# Altium project MMB_Power.PrjPcb
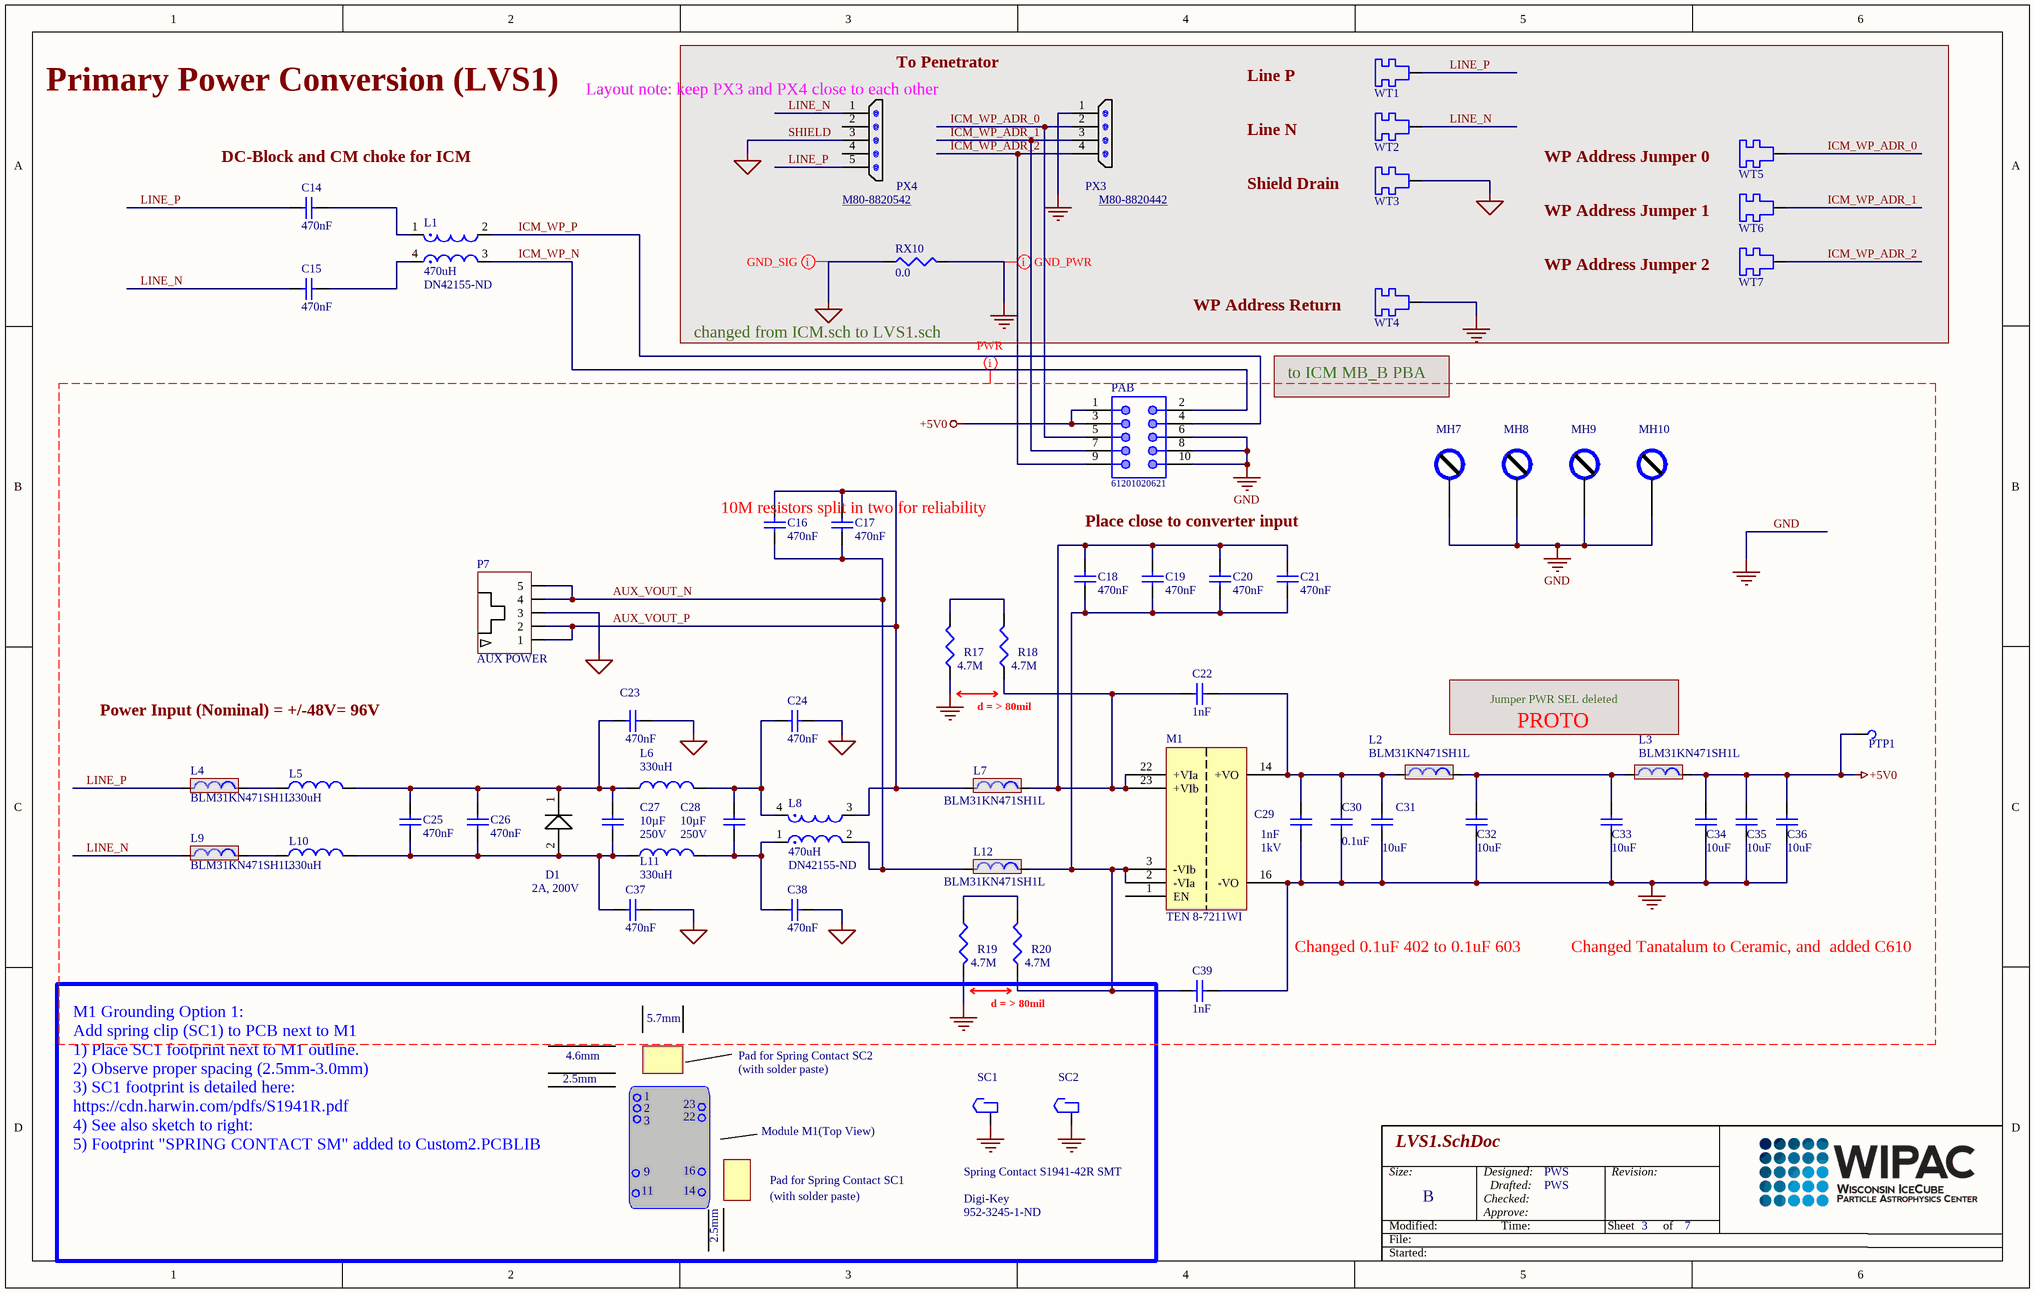
[diagram p0: LVS1.SchDoc]
1 sheet, 63 parts. Net scope: global (net labels, ports and power ports of the same name join across sheets).
Board file: MMB_Power_Board.PcbDoc

## Sheet LVS1.SchDoc
size B; DrawnBy: PWS; Engineer: PWS; DocumentNumber: 3; Revision: 2; SheetNumber: 3; SheetTotal: 7

### Parts
C14  Capacitance: 470nF  [1812]  (hidden comment: 470nF_1812_450V)
C15  Capacitance: 470nF  [1812]  (hidden comment: 470nF_1812_450V)
C16  Capacitance: 470nF  [1812]  (hidden comment: 470nF_1812_450V)
C17  Capacitance: 470nF  [1812]  (hidden comment: 470nF_1812_450V)
C18  Capacitance: 470nF  [1812]  (hidden comment: 470nF_1812_450V)
C19  Capacitance: 470nF  [1812]  (hidden comment: 470nF_1812_450V)
C20  Capacitance: 470nF  [1812]  (hidden comment: 470nF_1812_450V)
C21  Capacitance: 470nF  [1812]  (hidden comment: 470nF_1812_450V)
C22  Capacitance: 1nF  [CAPC_1206]  (hidden comment: 1000pF_1206_1000V)
C23  Capacitance: 470nF  [1812]  (hidden comment: 470nF_1812_450V)
C24  Capacitance: 470nF  [1812]  (hidden comment: 470nF_1812_450V)
C25  Capacitance: 470nF  [1812]  (hidden comment: 470nF_1812_450V)
C26  Capacitance: 470nF  [1812]  (hidden comment: 470nF_1812_450V)
C27  Capacitance: 10µF  Voltage Rating - DC: 250V  [Cap Radial 1.24" x 0.492" x 0.846]  (hidden comment: B32524R3106K)
C28  Capacitance: 10µF  Voltage Rating - DC: 250V  [Cap Radial 1.24" x 0.492" x 0.846]  (hidden comment: B32524R3106K)
C29  Capacitance: 1nF  Voltage Rating (DC): 1kV  [CAPC_1206]  (hidden comment: 1000pF_1206_1000V)
C30  Capacitance: 0.1uF  [CAPC_0603]  (hidden comment: 0.1uF_603_50V)
C31  Capacitance: 10uF  [CAPC_1206]  (hidden comment: 10uF_1206_16V)
C32  Capacitance: 10uF  [CAPC_1206]  (hidden comment: 10uF_1206_16V)
C33  Capacitance: 10uF  [CAPC_1206]  (hidden comment: 10uF_1206_16V)
C34  Capacitance: 10uF  [CAPC_1206]  (hidden comment: 10uF_1206_16V)
C35  Capacitance: 10uF  [CAPC_1206]  (hidden comment: 10uF_1206_16V)
C36  Capacitance: 10uF  [CAPC_1206]  (hidden comment: 10uF_1206_16V)
C37  Capacitance: 470nF  [1812]  (hidden comment: 470nF_1812_450V)
C38  Capacitance: 470nF  [1812]  (hidden comment: 470nF_1812_450V)
C39  Capacitance: 1nF  [CAPC_1206]  (hidden comment: 1000pF_1206_1000V)
D1  Ratings: 2A, 200V  [DO-214AC]  (hidden comment: BYG22DHE3_A/H)
L1  value 470uH  Supplier Part Number 1: DN42155-ND  [CM6350]  (hidden comment: CM6350R-474)
L2  BLM31KN471SH1L  [IND_1206]
L3  BLM31KN471SH1L  [IND_1206]
L4  BLM31KN471SH1L  [IND_1206]
L5  Inductance: 330uH  [IND_SMD_2P_10.4x10.4x4.8H]  (hidden comment: Inductor_330uH_590mA)
L6  Inductance: 330uH  [IND_SMD_2P_10.4x10.4x4.8H]  (hidden comment: Inductor_330uH_590mA)
L7  BLM31KN471SH1L  [IND_1206]
L8  value 470uH  Supplier Part Number 1: DN42155-ND  [CM6350]  (hidden comment: CM6350R-474)
L9  BLM31KN471SH1L  [IND_1206]
L10  Inductance: 330uH  [IND_SMD_2P_10.4x10.4x4.8H]  (hidden comment: Inductor_330uH_590mA)
L11  Inductance: 330uH  [IND_SMD_2P_10.4x10.4x4.8H]  (hidden comment: Inductor_330uH_590mA)
L12  BLM31KN471SH1L  [IND_1206]
M1  TEN 8-7211WI  [DC_DC_24DIP_9P__V1]
MH7  Mounting Hole  [Mounting Pad #4 - Standoff]  (value not drawn)  (no BOM)
MH8  Mounting Hole  [Mounting Pad #4 - Standoff]  (value not drawn)  (no BOM)
MH9  Mounting Hole  [Mounting Pad #4 - Standoff]  (value not drawn)  (no BOM)
MH10  Mounting Hole  [Mounting Pad #4 - Standoff]  (value not drawn)  (no BOM)
P7  AUX POWER  [Header Male 5 Vert]
PAB  61201020621  [61201020621]
PTP1  PC TEST POINT MINI SMD  [Test Point SM]  (value not drawn)
PX3  Harwin 4x1 2mm  [HARWIN M80-8820442]  (value not drawn)
PX4  Harwin 5x1 2mm  [HARWIN M80-8820542]  (value not drawn)
R17  Resistance: 4.7M  [RES_1206]  (hidden comment: R_4.7M_1206_1%)
R18  Resistance: 4.7M  [RES_1206]  (hidden comment: R_4.7M_1206_1%)
R19  Resistance: 4.7M  [RES_1206]  (hidden comment: R_4.7M_1206_1%)
R20  Resistance: 4.7M  [RES_1206]  (hidden comment: R_4.7M_1206_1%)
RX10  Resistance: 0.0  [RES_0805]  (hidden comment: R_ZERO_805)
SC1  Spring Contact S1941-42R SMT  Supplier 1: Digi-Key  Supplier Part Number 1: 952-3245-1-ND  [Spring Contact SM]
SC2  Spring Contact S1941-42R SMT  [Spring Contact SM]  (value not drawn)
WT1  Test Point Turret  [Turret-1592]  (value not drawn)
WT2  Test Point Turret  [Turret-1592]  (value not drawn)
WT3  Test Point Turret  [Turret-1592]  (value not drawn)
WT4  Test Point Turret  [Turret-1592]  (value not drawn)
WT5  Test Point Turret  [Turret-1592]  (value not drawn)
WT6  Test Point Turret  [Turret-1592]  (value not drawn)
WT7  Test Point Turret  [Turret-1592]  (value not drawn)

### Nets
+5V0: C34.2 C35.2 C36.2 L3.2 PAB.1 PAB.3 PTP1.1
GND: C29.2 C30.1 C31.1 C32.1 C33.1 C34.1 C35.1 C36.1 C39.1 M1.16(-VO) MH7.0 MH8.0 MH9.0 MH10.0 PAB.6 PAB.8 PAB.10 PX3.1 R17.1 R19.2 RX10.2 SC1.1 SC2.1 WT4.1
SHIELD: C23.1 C24.2 C37.2 C38.2 P7.3 PX4.3 RX10.1 WT3.1  [also labelled GND_S]
AUX_VOUT_N: C16.1 C17.1 L8.2 L12.1 P7.4 P7.5
AUX_VOUT_P: C16.2 C17.2 L7.1 L8.3 P7.1 P7.2
ICM_WP_ADR_0: PAB.5 PX3.2 WT5.1
ICM_WP_ADR_1: PAB.7 PX3.3 WT6.1
ICM_WP_ADR_2: PAB.9 PX3.4 WT7.1
ICM_WP_N: L1.3 PAB.2
ICM_WP_P: L1.2 PAB.4
LINE_N: C15.2 L9.1 PX4.1 WT2.1
LINE_P: C14.2 L4.1 PX4.5 WT1.1
NetC14_1: C14.1 L1.1
NetC15_1: C15.1 L1.4
NetC18_1: C18.1 C19.1 C20.1 C21.1 C39.2 L12.2 M1.2(-VIa) M1.3(-VIb) R20.1
NetC18_2: C18.2 C19.2 C20.2 C21.2 C22.2 L7.2 M1.22(+VIa) M1.23(+VIb) R18.1
NetC22_1: C22.1 C29.1 C30.2 C31.2 L2.1 M1.14(+VO)
NetC23_2: C23.2 C25.1 C26.1 C27.2 D1.1 L5.2 L6.1
NetC24_1: C24.1 C28.2 L6.2 L8.4
NetC25_2: C25.2 C26.2 C27.1 C37.1 D1.2 L10.2 L11.1
NetC28_1: C28.1 C38.1 L8.1 L11.2
NetC32_2: C32.2 C33.2 L2.2 L3.1
NetL4_2: L4.2 L5.1
NetL9_2: L9.2 L10.1
NetR17_2: R17.2 R18.2
NetR19_1: R19.1 R20.2

Not connected (* = marked no-connect by the designer): M1 1(EN); PX4 2 4

### Layout directives
net class Power Nets: +5V0, AUX_VOUT_N, AUX_VOUT_P, GND, GND_S, LINE_N, LINE_P
net class GND_SIG: SHIELD
net class GND_PWR: GND

### Notes on the sheet
- Primary Power Conversion (LVS1)
- (near PX4) Layout note: keep PX3 and PX4 close to each other
- (near PX4) To Penetrator
- Line P
- (near C14) DC-Block and CM choke for ICM
- Line N
- WP Address Jumper 0
- (near PX4) M80-8820542
- (near PX3) M80-8820442
- Shield Drain
- WP Address Jumper 1
- WP Address Jumper 2
- changed from ICM.sch to LVS1.sch
- WP Address Return
- to ICM MB_B PBA
- 10M resistors split in two for reliability
- Place close to converter input
- Jumper PWR SEL deleted
- Power Input (Nominal) = +/-48V= 96V
- d = > 80mil
- PROTO
- Changed 0.1uF 402 to 0.1uF 603
- Changed Tanatalum to Ceramic, and  added C610
- 5.7mm
- 2.5mm
- 4.6mm
- 1
- 2
- 23
- Pad for Spring Contact SC2
- (with solder paste)
- 3
- 9
- 16
- 22
- Module M1(Top View)
- M1 Grounding Option 1:
  Add spring clip (SC1) to PCB next to M1
  1) Place SC1 footprint next to M1 outline.
  2) Observe proper spacing (2.5mm-3.0mm)
  3) SC1 footprint is detailed here: https://cdn.harwin.com/pdfs/S1941R.pdf
  4) See also sketch to right:
  5) Footprint "SPRING CONTACT SM" added to Custom2.PCBLIB
- 11
- 14
- Pad for Spring Contact SC1
- Size:
- Designed:
- Revision:
- Modified:
- File:
- B
- Checked:
- Approve:
- Drafted:
- Time:
- Sheet
- of
- Started:

### Library data of the parts
C14-C21 C23-C26 C37 C38 = CapC_470nF_1812_450V: Capacitor; Manufacturer: TDK; Manufacturer Part Number: CGA8N4X7T2W474M230KE; Tolerance: 20%; Voltage Rating: 450V; Dielectric: X7T; Supplier 1: Digi-Key; RoHS: Yes; Stock 1: 3188; Pricing 1: 1 = 1.72000, 10 = 1.39200, 100 = 1.06260 (USD); Packaging: Tape and Reel; Ratings: AEC-Q200; Features: Soft Termination; ComponentLink1URL: https://product.tdk.com/info/en/catalog/datasheets/mlcc_automotive_soft_en.pdf; ComponentLink1Description: Datasheet; Supplier Part Number 1: 445-7993-1-ND; ComponentLink2Description: Supplier Link; ComponentLink2URL: https://www.digikey.com/product-detail/en/tdk-corporation/CGA8N4X7T2W474M230KE/445-7993-1-ND/2782561; Mount: Surface Mount; Case/Package: 1812; Weight: 0.000952oz; Case Code (Imperial): 1812; Case Code (Metric): 4532; Min Operating Temperature: -55°C; Max Operating Temperature: 125°C; Termination: SMD/SMT; Voltage Rating (DC): 450V; Package Quantity: 1; Length: 4.5mm; Height: 2.3mm; Width: 3.2mm; Thickness: 0.091inch; Depth: 3.2mm; REACH SVHC: No SVHC; ComponentLink3URL: http://www.mouser.com/ds/2/400/lcc_commercial_soft_en-775842.pdf?src-supplier=Mouser; ComponentLink3Description: http://www.mouser.com/ds/2/400/lcc_commercial_soft_en-775842.pdf?src-supplier=Mouser; ComponentLink4URL: http://components.arrow.com/part/dataview/0323_06888689?src-supplier=Arrow+Europe; ComponentLink4Description: http://components.arrow.com/part/dataview/0323_06888689?src-supplier=Arrow+Europe; ComponentLink5URL: http://www.farnell.com/datasheets/2016103.pdf?src-supplier=Farnell; ComponentLink5Description: http://www.farnell.com/datasheets/2016103.pdf?src-supplier=Farnell; ComponentLink6URL: http://components.arrow.com/part/dataview/57435482S457154N1165?src-supplier=Arrow; ComponentLink6Description: http://components.arrow.com/part/dataview/57435482S457154N1165?src-supplier=Arrow; ComponentLink7URL: http://www.farnell.com/datasheets/1839935.pdf?src-supplier=Element14; ComponentLink7Description: http://www.farnell.com/datasheets/1839935.pdf?src-supplier=Element14; ComponentLink8URL: https://product.tdk.com/info/en/documents/chara_sheet/CGA8N4X7T2W474M230KE.pdf?src-supplier=Digi-Key; ComponentLink8Description: https://product.tdk.com/info/en/documents/chara_sheet/CGA8N4X7T2W474M230KE.pdf?src-supplier=Digi-Key; ComponentLink9URL: https://product.tdk.com/info/en/catalog/datasheets/mlcc_automotive_soft_en.pdf?src-supplier=Digi-Key; ComponentLink9Description: https://product.tdk.com/info/en/catalog/datasheets/mlcc_automotive_soft_en.pdf?src-supplier=Digi-Key
C22 C39 = CapC_1000pF_1206_1000V: Capacitor; Manufacturer: KEMET; Manufacturer Part Number: C1206X102KDRACAUTO; Tolerance: 10%; Dielectric Material: Ceramic; Voltage Rating (DC): 1kV; Dielectric: X7R; Supplier 1: Digi-Key; RoHS: No; Stock 1: 2753; Pricing 1: 1 = 0.85000, 10 = 0.62600, 100 = 0.42910, 500 = 0.33972, 1000 = 0.28608 (USD); ComponentLink1URL: https://www.digikey.com/products/en?keywords=399-16729-1-ND; ComponentLink1Description: Supplier Link; Supplier Part Number 1: 399-16729-1-ND; ComponentLink2Description: Data Sheet; ComponentLink2URL: https://api.kemet.com/component-edge/download/datasheet/C1206X102KDRACAUTO.pdf; Case/Package: 1206; ComponentLink3URL: https://api.kemet.com/component-edge/download/datasheet/C1206X102KDRACAUTO.pdf?src-supplier=Digi-Key; ComponentLink3Description: https://api.kemet.com/component-edge/download/datasheet/C1206X102KDRACAUTO.pdf?src-supplier=Digi-Key; ComponentLink4URL: https://api.kemet.com/component-edge/download/specsheet/C1206X102KDRACAUTO.pdf?src-supplier=Digi-Key; ComponentLink4Description: https://api.kemet.com/component-edge/download/specsheet/C1206X102KDRACAUTO.pdf?src-supplier=Digi-Key
C27 C28 = CAP_FILM_10UF_250V_RAD: CAP FILM 10UF 250V RAD; Manufacturer: EPCOS Inc; Tolerance: ±10%; Voltage Rating - AC: 160V; Dielectric Material: Polyester, Polyethylene Terephthalate (PET); Supplier 1: Digi-Key; Manufacturer Part Number: B32524R3106K; RoHS: RoHS Compliant; Category: Capacitors; Stock 1: 2797; Pricing 1: 1=5.27, 10=4.741, 100=3.5819, 500=2.9498, 1000=2.7391, 5000=2.63375, 10000=2.61268 (USD); Packaging: Bulk; ESR (Equivalent Series Resistance): -; Operating Temperature: -55°C ~ 125°C; Mounting Type: Through Hole; Package / Case: Radial; Size / Dimension: 1.240" L x 0.492" W (31.50mm x 12.50mm); Height - Seated (Max): 0.846" (21.50mm); Termination: PC Pins; Lead Spacing: 1.083" (27.50mm); Applications: General Purpose; Features: -; ComponentLink1URL: http://en.tdk.eu/inf/20/20/db/fc_2009/B32520_529.pdf; ComponentLink1Description: http://en.tdk.eu/inf/20/20/db/fc_2009/B32520_529.pdf; Supplier Part Number 1: 495-4799-ND
C29 = CapC_1000pF_1206_1000V: Capacitor; Manufacturer: KEMET; Manufacturer Part Number: C1206X102KDRACAUTO; Tolerance: 10%; Dielectric Material: Ceramic; Dielectric: X7R; Supplier 1: Digi-Key; RoHS: No; Stock 1: 2753; Pricing 1: 1 = 0.85000, 10 = 0.62600, 100 = 0.42910, 500 = 0.33972, 1000 = 0.28608 (USD); ComponentLink1URL: https://www.digikey.com/products/en?keywords=399-16729-1-ND; ComponentLink1Description: Supplier Link; Supplier Part Number 1: 399-16729-1-ND; ComponentLink2Description: Data Sheet; ComponentLink2URL: https://api.kemet.com/component-edge/download/datasheet/C1206X102KDRACAUTO.pdf; Case/Package: 1206; ComponentLink3URL: https://api.kemet.com/component-edge/download/datasheet/C1206X102KDRACAUTO.pdf?src-supplier=Digi-Key; ComponentLink3Description: https://api.kemet.com/component-edge/download/datasheet/C1206X102KDRACAUTO.pdf?src-supplier=Digi-Key; ComponentLink4URL: https://api.kemet.com/component-edge/download/specsheet/C1206X102KDRACAUTO.pdf?src-supplier=Digi-Key; ComponentLink4Description: https://api.kemet.com/component-edge/download/specsheet/C1206X102KDRACAUTO.pdf?src-supplier=Digi-Key
C30 = CapC_0.1uF_603_50V_GCJ: 0.1µF ±10% 50V Ceramic Capacitor X7R 0603 (1608 Metric); Manufacturer: Murata; Manufacturer Part Number: GCJ188R71H104KA12D; Supplier 1: Digi-Key; Supplier Part Number 1: 490-5798-1-ND; RoHS: Yes; Packaging: Tape and Reel; Tolerance: 10%; Ratings: AEC-Q200; ComponentLink1URL: https://psearch.en.murata.com/capacitor/product/GCJ188R71H104KA12%23.pdf; ComponentLink1Description: Datasheet; ComponentLink2Description: Supplier Link; ComponentLink2URL: https://www.digikey.com/products/en?keywords=490-5798-1-ND; Stock 1: 2321609; Pricing 1: 1=0.28000, 10=0.19200, 100=0.10890, 500=0.07686, 1000=0.06725 (USD); Mount: Surface Mount; Case/Package: 0603; Case Code (Imperial): 0603; Case Code (Metric): 1608; Min Operating Temperature: -55°C; Max Operating Temperature: 125°C; Voltage Rating: 50V; Dielectric: X7R; Termination: SMD/SMT; Voltage Rating (DC): 50V; Package Quantity: 1; Length: 1.6mm; Height: 0.8mm; Width: 0.031inch; Thickness: 0.035inch; Features: Soft Termination; Depth: 0.8mm; Radiation Hardening: No; Lead Free: Lead Free
C31-C36 = CapC_10uF_1206_16V: Capacitor; Manufacturer: Murata; Manufacturer Part Number: GCJ31CR71C106KA15L; Voltage Rating: 16V; Tolerance: 10%; Dielectric: X7R; Supplier 1: Digi-Key; Stock 1: 43020; Pricing 1: 1 = 0.79000, 10 = 0.56200, 100 = 0.36990, 500 = 0.27402, 1000 = 0.23292 (USD); RoHS: Yes; Mount: Surface Mount; Case/Package: 1206; Case Code (Metric): 3216; Case Code (Imperial): 1206; Min Operating Temperature: -55°C; Max Operating Temperature: 125°C; Package Quantity: 2000; Packaging: Tape and Reel; Termination: SMD/SMT; Voltage Rating (DC): 16V; Features: Soft Termination; Length: 0.126inch; Width: 1.6mm; Thickness: 0.075inch; Ratings: AEC-Q200; ComponentLink1URL: https://www.murata.com/~/media/webrenewal/support/library/catalog/products/capacitor/mlcc/c03e.ashx?la=en-us; ComponentLink1Description: Datasheet; Supplier Part Number 1: 490-10558-1-ND; ComponentLink2Description: Supplier Link; ComponentLink2URL: https://www.digikey.com/products/en?keywords=490-10558-1-ND; Weight: 0.001411oz; Height: 1.25mm
D1 = DIODE AVALANCHE 200V 2.0A: Diode Avalanche 200V 2A Surface Mount DO-214AC (SMA); Manufacturer: Vishay Semiconductors; Supplier 1: Digi-Key; Manufacturer Part Number: BYG22DHE3_A/H; RoHS: No; Stock 1: 1303; Pricing 1: 1=0.50000, 10=0.42500, 100=0.31720, 500=0.24926 (USD); ComponentLink1URL: http://www.vishay.com/docs/88959/byg22a.pdf; ComponentLink1Description: Datasheet; Supplier Part Number 1: BYG22DHE3_A/HGICT-ND; ComponentLink2Description: Supplier Link; ComponentLink2URL: https://www.digikey.com/products/en?keywords=BYG22DHE3_A%2FHGICT-ND; ComponentLink3URL: http://www.vishay.com/docs/88959/byg22a.pdf?src-supplier=Digi-Key; ComponentLink3Description: http://www.vishay.com/docs/88959/byg22a.pdf?src-supplier=Digi-Key
L1 L8 = INDUCTOR COM MODE FERR 470.0UH SMD: Manufacturer: API Delevan Inc; Filter Type: Power Line; Number of Lines: 2; Inductance: 470µH; Current: 1.5A; DC Resistance (DCR): 60 mOhm Max; Supplier 1: Digi-Key; Manufacturer Part Number: CM6350R-474; RoHS: RoHS Compliant; Category: Filters; Stock 1: 1684; Pricing 1: 1=7.7, 10=6.93, 25=6.16, 50=5.236, 100=4.928, 500=4.62, 1000=4.312, 2500=4.0964 (USD); Packaging: Bulk; Impedance: -; Mounting Type: Surface Mount; Size / Dimension: 0.360" L x 0.360" W (9.14mm x 9.14mm); Height (Max): 0.210" (5.33mm); Package / Case: Horizontal, 4 PC Pad; Operating Temperature: -55°C ~ 105°C; ComponentLink1URL: http://www.delevan.com/seriesPDFs/CM6350.pdf; ComponentLink1Description: http://www.delevan.com/seriesPDFs/CM6350.pdf
L2-L4 L7 L9 L12 = Ferrite BLM31KN471SH1L: 470 Ohms @ 100MHz 1 Power Line Ferrite Bead 1206 (3216 Metric) 4A 20mOhm; Manufacturer: Murata; ComponentLink1Description: Datasheet; ComponentLink1URL: https://www.murata.com/en-us/products/productdata/8801529495582/QNFA9148.pdf; ComponentLink2Description: Supplier Link; ComponentLink2URL: https://www.digikey.com/products/en?keywords=490-16529-1-ND; Supplier 1: Digi-Key; Manufacturer Part Number: BLM31KN471SH1L; RoHS: No; Stock 1: 9055; Pricing 1: 1=0.32000, 10=0.25300, 25=0.21400, 50=0.18820, 100=0.16830, 250=0.14652, 500=0.13266, 1000=0.11286 (USD); Supplier Part Number 1: 490-16529-1-ND
L5 L6 L10 L11 = Inductor_330uH_590mA: Inductor; Manufacturer: TDK EPCOS; Manufacturer Part Number: B82464G4334M000; Core Material: Ferrite; Shielding: Shielded; Tolerance: 20%; Test Frequency: 100kHz; RMS Current (Irms): 590mA; Saturation Current: 650mA; DC Resistance (DCR): 650mR; Current Rating: 550mA; Supplier 1: Digi-Key; RoHS: Yes; Stock 1: 1184; Pricing 1: 1 = 2.54000, 10 = 2.34600, 100 = 1.64220 (USD); Packaging: Tape and Reel; ComponentLink1URL: https://www.tdk-electronics.tdk.com/inf/30/db/ind_2008/b82464g4.pdf; ComponentLink1Description: Datasheet; Supplier Part Number 1: 495-1804-1-ND; Mount: Surface Mount; Case/Package: SMD/SMT; Inductance Tolerance: 20%; DC Current: 590mA; Military Standard: Not; Max DC Current: 590mA; Length: 10.4mm; Height: 3mm; Width: 10.4mm; Depth: 10.4mm; REACH SVHC: No SVHC; ComponentLink2URL: https://www.digikey.com/products/en?keywords=495-1804-1-NDhttps://datasheet.ciiva.com/22623/1899158-22623103.pdf?src-supplier=Element14; ComponentLink2Description: Supplier Link
M1 = DC-DC 24 Pin 5Vo: Manufacturer: Traco Power; Current - Output 1: 1.6A; Efficiency: 85%; Isolation: Isolated; Isolation Voltage: 1.5kV; Max Input Voltage (DC): 160V; Max Output Power: 8W; Min Input Voltage (DC): 43V; Nominal Input Voltage: 72V; Nominal Output Voltage: 5V; Number of Outputs: 1; Supplier 1: Digi-Key; Manufacturer Part Number: TEN8-7211WI; RoHS: Yes; Stock 1: 224; Pricing 1: 1 = 47.60000, 10 = 40.93400, 25 = 39.63480, 50 = 37.68560, 100 = 35.08650, 250 = 34.56672, 500 = 31.18800 (USD); ComponentLink1URL: https://www.digikey.com/product-detail/en/traco-power/TEN-8-7211WI/1951-2576-ND/9383611; ComponentLink1Description: Supplier Link; Supplier Part Number 1: 1951-2576-ND; ComponentLink2Description: Datasheet; ComponentLink2URL: https://www.tracopower.com/products/ten8wi.pdf; Depth: 20.3mm; Height: 10.2mm; Length: 32mm; Max Input Voltage: 160V; Max Operating Temperature: 85°C; Max Output Current: 1.6A; Min Input Voltage: 43V; Min Operating Temperature: -40°C; Mount: Through Hole; Number of Pins: 9; Output Current: 1.6A; Output Power: 8W; Output Voltage: 5V; Radiation Hardening: No; REACH SVHC: No SVHC; Voltage - Output 1: 5V; Weight: 18g; Width: 20.3mm; ComponentLink3Description: Application Note; ComponentLink3URL: https://assets.tracopower.com/20190902135529/TEN8WI/documents/ten8wi-application.pdf
MH7-MH10 = Mounting Hole #4_Standoff
P7 = Header Male SL-5-VERT: CONN HEADER 5POS .100 VERT 30AU; Manufacturer: Molex; Manufacturer Part Number: 70543-0109; Number of Positions: 5; Current Rating: 3A; Voltage Rating: 250V; Contact Resistance: 30mR; Gender: Male; Pitch: 2.54mm; Glow Wire Compliant: Non-compliant; Category: Connectors, Interconnects; Supplier 1: Digi-Key; Stock 1: 2124; Pricing 1: 1=2.24000, 10=2.03400, 100=1.74300, 500=1.45250, 1680=1.20350, 5040=1.10390 (USD); RoHS: Yes; Mount: Through Hole; Housing Material: Thermoplastic; Contact Plating: Gold; Contact Material: Bronze; Color: Black; Material: Brass; Min Operating Temperature: -40°C; Max Operating Temperature: 105°C; Number of Rows: 1; Packaging: Rail/Tube; Termination: Through Hole; Number of Contacts: 5; Orientation: Vertical; Package Quantity: 1680; Number of Circuits: 5; Voltage Rating (DC): 250V; Flammability Rating: UL94 V-0; REACH SVHC: Unknown; ELV: Compliant; ComponentLink1Description: Supplier Link; ComponentLink1URL: https://www.digikey.com/products/en?keywords=WM4125-ND; ComponentLink2Description: MFG Drawing; ComponentLink2URL: https://www.molex.com/pdm_docs/sd/705430106_sd.pdf; Supplier Part Number 1: WM4125-ND
PAB = 61201020621: Male Box Header WR-BHD, SMT, Vertical, pitch 2.54 mm, 10 pins; Pitch: 2.54 mm; Working Voltage: 250 VAC; Withstanding Voltage: 500 VAC; Contact Resistance: 20 mOhm; Pin Number: 10; ComponentLink1Description: Manufacturer; ComponentLink1URL: http://www.we-online.de; ComponentLink2Description: Datasheet; ComponentLink2URL: https://katalog.we-online.de/em/datasheet/6120xx20621.pdf; Part Number: 61201020621; Published Date: August 2018; Publisher: Wurth Elektronik; Operating Temperature: -40 to 125 degC; Packaging: Tube; Gender: Male; Mounting Technology: SMT; Orientation: Vertical
PTP1 = Test Point SM: 5019KCT-ND; Manufacturer: Keystone Electronics; Manufacturer Part Number: 5019; Supplier 1: Digi-Key; Supplier Part Number 1: 5019KCT-ND; RoHS: RoHS Compliant; Category: Test and Measurement; Stock: 10485; Pricing: 1=0.3, 10=0.287, 50=0.2092, 100=0.201, 250=0.18048, 500=0.17228 (USD); Packaging: Cut Tape (CT); Type: PC Test Point, Miniature; Terminal: 0.015" (0.38mm) Phosphor Bronze, Silver Plated; Mounting Type: Surface Mount; Material: Phosphor Bronze; Color: -; ComponentLink1URL: http://www.keyelco.com/product-pdf.cfm?p=1357; ComponentLink1Description: http://www.keyelco.com/product-pdf.cfm?p=1357
PX3 = Harwin 4x1 2mm: Connector Header Through Hole 4 position 0.079" (2.00mm)  M80-8820442; Current Rating: 3A; Voltage Rating: 120V; Connector Type: Male Pin; Number of Positions: 4; Gender: Male; Contact Resistance: 25mR; ComponentLink1Description: Supplier Link; ComponentLink1URL: https://www.digikey.com/products/en?keywords=M80-8820442; ComponentLink3Description: Datasheet - Specifications; ComponentLink3URL: https://cdn.harwin.com/pdfs/C005XX_M80_and_M83_Datamate_Series_Connectors.pdf; ComponentLink4Description: Datamate Catalog; ComponentLink4URL: https://cdn.harwin.com/pdfs/Harwin_PC_Datamate.pdf; Supplier 1: Digi-Key; Manufacturer: Harwin; Manufacturer Part Number: M80-8820442; Stock 1: 241; Pricing 1: 1=2.73000, 21=2.61619, 105=2.18000, 504=1.85300, 1008=1.58050, 5019=1.41700 (USD); RoHS: Yes; Mount: Through Hole; Case/Package: SIL; Housing Material: Polyamide; Contact Material: Bronze; Color: Black; Contact Plating: Gold; Housing Color: Black; Min Operating Temperature: -55°C; Max Operating Temperature: 125°C; Number of Rows: 1; Fastening Type: Latch; Packaging: Rail/Tube; Contact Gender: Male; Termination: Solder; Number of Contacts: 4; Orientation: Straight; Max Current Rating: 3A; Max Voltage Rating (AC): 120V; Package Quantity: 21; Max Voltage Rating (DC): 120V; Length: 11.6mm; Pitch: 2mm; Depth: 3.8mm; Radiation Hardening: No; REACH SVHC: No SVHC; ComponentLink7URL: https://datasheet.ciiva.com/733/m80-882-733796.pdf?src-supplier=Digi-Key; ComponentLink7Description: Datasheet; Supplier Part Number 1: 952-1071-5-ND
PX4 = Harwin 5x1 2mm: CONN HEADER VERT 5POS 2MM   M80-8820542; Current Rating: 3A; Voltage Rating: 120V; Connector Type: Male Pin; Number of Positions: 5; Gender: Male; Contact Resistance: 25mR; ComponentLink1Description: Supplier Link; ComponentLink1URL: https://www.digikey.com/products/en?keywords=M80-8820542; ComponentLink2Description: Datasheet - Dimensions; ComponentLink2URL: https://cdn.harwin.com/pdfs/M80-882.pdf; ComponentLink3Description: Datasheet - Specifications; ComponentLink3URL: https://cdn.harwin.com/pdfs/C005XX_M80_and_M83_Datamate_Series_Connectors.pdf; ComponentLink4Description: Datamate Catalog; ComponentLink4URL: https://cdn.harwin.com/pdfs/Harwin_PC_Datamate.pdf; Supplier 1: Digi-Key; Manufacturer: Harwin; Manufacturer Part Number: M80-8820542; Stock 1: 537; Pricing 1: 1=2.80000, 18=2.68778, 108=2.24000, 504=1.90401, 1008=1.62400, 5004=1.45600 (USD); RoHS: Yes; Mount: Through Hole; Case/Package: SIL; Housing Material: Thermoplastic; Contact Material: Bronze; Contact Plating: Gold; Color: Black; Housing Color: Black; Min Operating Temperature: -55°C; Max Operating Temperature: 125°C; Number of Rows: 1; Packaging: Rail/Tube; Fastening Type: Latch; Contact Gender: Male; Termination: Solder; Number of Contacts: 5; Orientation: Straight; Max Current Rating: 3A; Max Voltage Rating (AC): 120V; Length: 13.6mm; Pitch: 2mm; Depth: 3.8mm; Radiation Hardening: No; REACH SVHC: No SVHC; ComponentLink5URL: https://datasheet.ciiva.com/11749/0900766b80b6afca-11749442.pdf?src-supplier=RSComponents; ComponentLink5Description: https://datasheet.ciiva.com/11749/0900766b80b6afca-11749442.pdf?src-supplier=RSComponents; ComponentLink6URL: https://datasheet.ciiva.com/733/m80-882-733797.pdf?src-supplier=Digi-Key; ComponentLink6Description: https://datasheet.ciiva.com/733/m80-882-733797.pdf?src-supplier=Digi-Key; ComponentLink7URL: https://datasheet.ciiva.com/41451/001233466-da-01-en-buchsenleiste-gerade-m80-8820542-41451446.pdf?src-supplier=Conrad; ComponentLink7Description: https://datasheet.ciiva.com/41451/001233466-da-01-en-buchsenleiste-gerade-m80-8820542-41451446.pdf?src-supplier=Conrad; Supplier Part Number 1: 952-1072-5-ND
R17-R20 = R_4.7M_1206_1%: 4.7 MOhms ±1% 0.25W, 1/4W Chip Resistor 1206 (3216 Metric) Automotive AEC-Q200, High Voltage Thick Film; Manufacturer: Rohm; Manufacturer Part Number: KTR18EZPF4704; Power Rating: 250mW; Temperature Coefficient: 100ppm/°C; ComponentLink1Description: Datasheet; ComponentLink1URL: https://www.rohm.com/datasheet/KTR03EZPF/ktr-e; ComponentLink2Description: Supplier Link; ComponentLink2URL: https://www.digikey.com/products/en?keywords=RHM4.7MAICT-ND; Supplier 1: Digi-Key; Stock 1: 6349; Pricing 1: 1=0.21000, 10=0.17800, 100=0.06950, 1000=0.02911, 2500=0.02668 (USD); RoHS: Yes; Tolerance: 1%; Lead Free: Lead Free; ComponentLink3URL: https://www.rohm.com/datasheet/KTR03EZPF/ktr-e?src-supplier=Digi-Key; ComponentLink3Description: https://www.rohm.com/datasheet/KTR03EZPF/ktr-e?src-supplier=Digi-Key; ComponentLink4URL: http://rohmfs.rohm.com/en/products/databook/datasheet/passive/resistor/chip_resistor/ktr.pdf?src-supplier=Future+Electronics; ComponentLink4Description: http://rohmfs.rohm.com/en/products/databook/datasheet/passive/resistor/chip_resistor/ktr.pdf?src-supplier=Future+Electronics; Supplier Part Number 1: RHM4.7MAICT-ND
RX10 = R_ZERO_805: RES ZERO OHM 0805 SMD; Manufacturer: Panasonic; Manufacturer Part Number: ERJ6GEY0R00V; Tolerance: 5%; Temperature Coefficient: 600ppm/°C; Voltage Rating: 150V; Power Rating: 125mW; Current Rating: 2A; Supplier 1: Digi-Key; Supplier Part Number 1: P0.0ACT-ND; RoHS: Yes; Packaging: Tape and Reel; Composition: Thick Film; Features: Automotive AEC-Q200; Height: 0.6mm; Number of Terminations: 2; ComponentLink1URL: https://datasheet.ciiva.com/11821/0900766b80f806dd-11821735.pdf?src-supplier=RSComponents; ComponentLink1Description: https://datasheet.ciiva.com/11821/0900766b80f806dd-11821735.pdf?src-supplier=RSComponents; Stock 1: 5556612; Pricing 1: 1 = 0.10000, 10 = 0.06000, 25 = 0.04320, 50 = 0.03300, 100 = 0.02430, 250 = 0.01852, 500 = 0.01482, 1000 = 0.01090 (USD); Mount: Surface Mount; Case/Package: 0805; Contact Plating: Tin; Case Code (Imperial): 0805; Case Code (Metric): 2012; Min Operating Temperature: -55°C; Max Operating Temperature: 155°C; Package Quantity: 1; Termination: SMD/SMT; Military Standard: Not; Max Power Dissipation: 125mW; Voltage Rating (DC): 150V; Length: 2mm; Width: 1.25mm; Depth: 1.25mm; Radiation Hardening: No; Lead Free: Lead Free; REACH SVHC: No SVHC; ComponentLink2URL: https://datasheet.ciiva.com/36526/1989607-36526237.pdf?src-supplier=Jameco; ComponentLink2Description: https://datasheet.ciiva.com/36526/1989607-36526237.pdf?src-supplier=Jameco; ComponentLink3URL: https://datasheet.ciiva.com/28695/1678796-28695877.pdf?src-supplier=Element14; ComponentLink3Description: https://datasheet.ciiva.com/28695/1678796-28695877.pdf?src-supplier=Element14; ComponentLink4URL: https://datasheet.ciiva.com/43460/1678796-43460073.pdf?src-supplier=Farnell; ComponentLink4Description: https://datasheet.ciiva.com/43460/1678796-43460073.pdf?src-supplier=Farnell; ComponentLink5URL: https://datasheet.ciiva.com/9117/aoa0000ce1-9117354.pdf?src-supplier=Avnet; ComponentLink5Description: https://datasheet.ciiva.com/9117/aoa0000ce1-9117354.pdf?src-supplier=Avnet; ComponentLink6URL: https://datasheet.ciiva.com/46377/1678796-46377866.pdf?src-supplier=Element14; ComponentLink6Description: https://datasheet.ciiva.com/46377/1678796-46377866.pdf?src-supplier=Element14; ComponentLink7URL: https://datasheet.ciiva.com/17215/aoa0000ce1-17215390.pdf?src-supplier=Avnet+Europe; ComponentLink7Description: https://datasheet.ciiva.com/17215/aoa0000ce1-17215390.pdf?src-supplier=Avnet+Europe; ComponentLink8URL: https://datasheet.ciiva.com/16512/aoa0000ce1-16512111.pdf?src-supplier=Avnet+Asia; ComponentLink8Description: https://datasheet.ciiva.com/16512/aoa0000ce1-16512111.pdf?src-supplier=Avnet+Asia
SC1 SC2 = Spring Contact: RFI SHIELD FINGER GOLD SMD; Manufacturer: Harwin; ComponentLink1Description: Drawing; ComponentLink1URL: https://cdn.harwin.com/pdfs/S1941R.pdf; ComponentLink2Description: Supplier Link; ComponentLink2URL: https://www.digikey.com/products/en?keywords=952-3245-1-ND; Manufacturer Part Number: S1941-42R; Stock 1: 2973; Pricing 1: 1=0.68000, 10=0.56900, 25=0.49760, 100=0.42640 (USD); RoHS: No
  SC2: Supplier 1: Digi-Key; Supplier Part Number 1: 952-3245-1-ND
WT1-WT7 = Test Point Turret: TERM TURRET SNG; Manufacturer: Mill-Max; Manufacturer Part Number: 2506-3-00-80-00-00-07-0; Board Thickness: 2.39mm; Plating: Tin; Gender: Male; Outside Diameter: 3.18mm; Hole Diameter: 1.7mm; Supplier 1: Digi-Key; RoHS: Yes; Stock 1: 25825; Pricing 1: 1 = 0.87000, 10 = 0.76500, 25 = 0.72000, 50 = 0.69000, 100 = 0.66000, 250 = 0.60000, 500 = 0.54000, 1000 = 0.48000, 2500 = 0.43500 (USD); ComponentLink1URL: https://www.mill-max.com/assets/pdfs/232.pdf; ComponentLink1Description: Data Sheet 2506-3; Supplier Part Number 1: ED11398-ND; Mount: PCB; Material: Brass; Package Quantity: 500; Packaging: Bulk; Length: 6.88mm